# Altium schematic sheet Multi-Sensor-V2.0.SchDoc
size A2
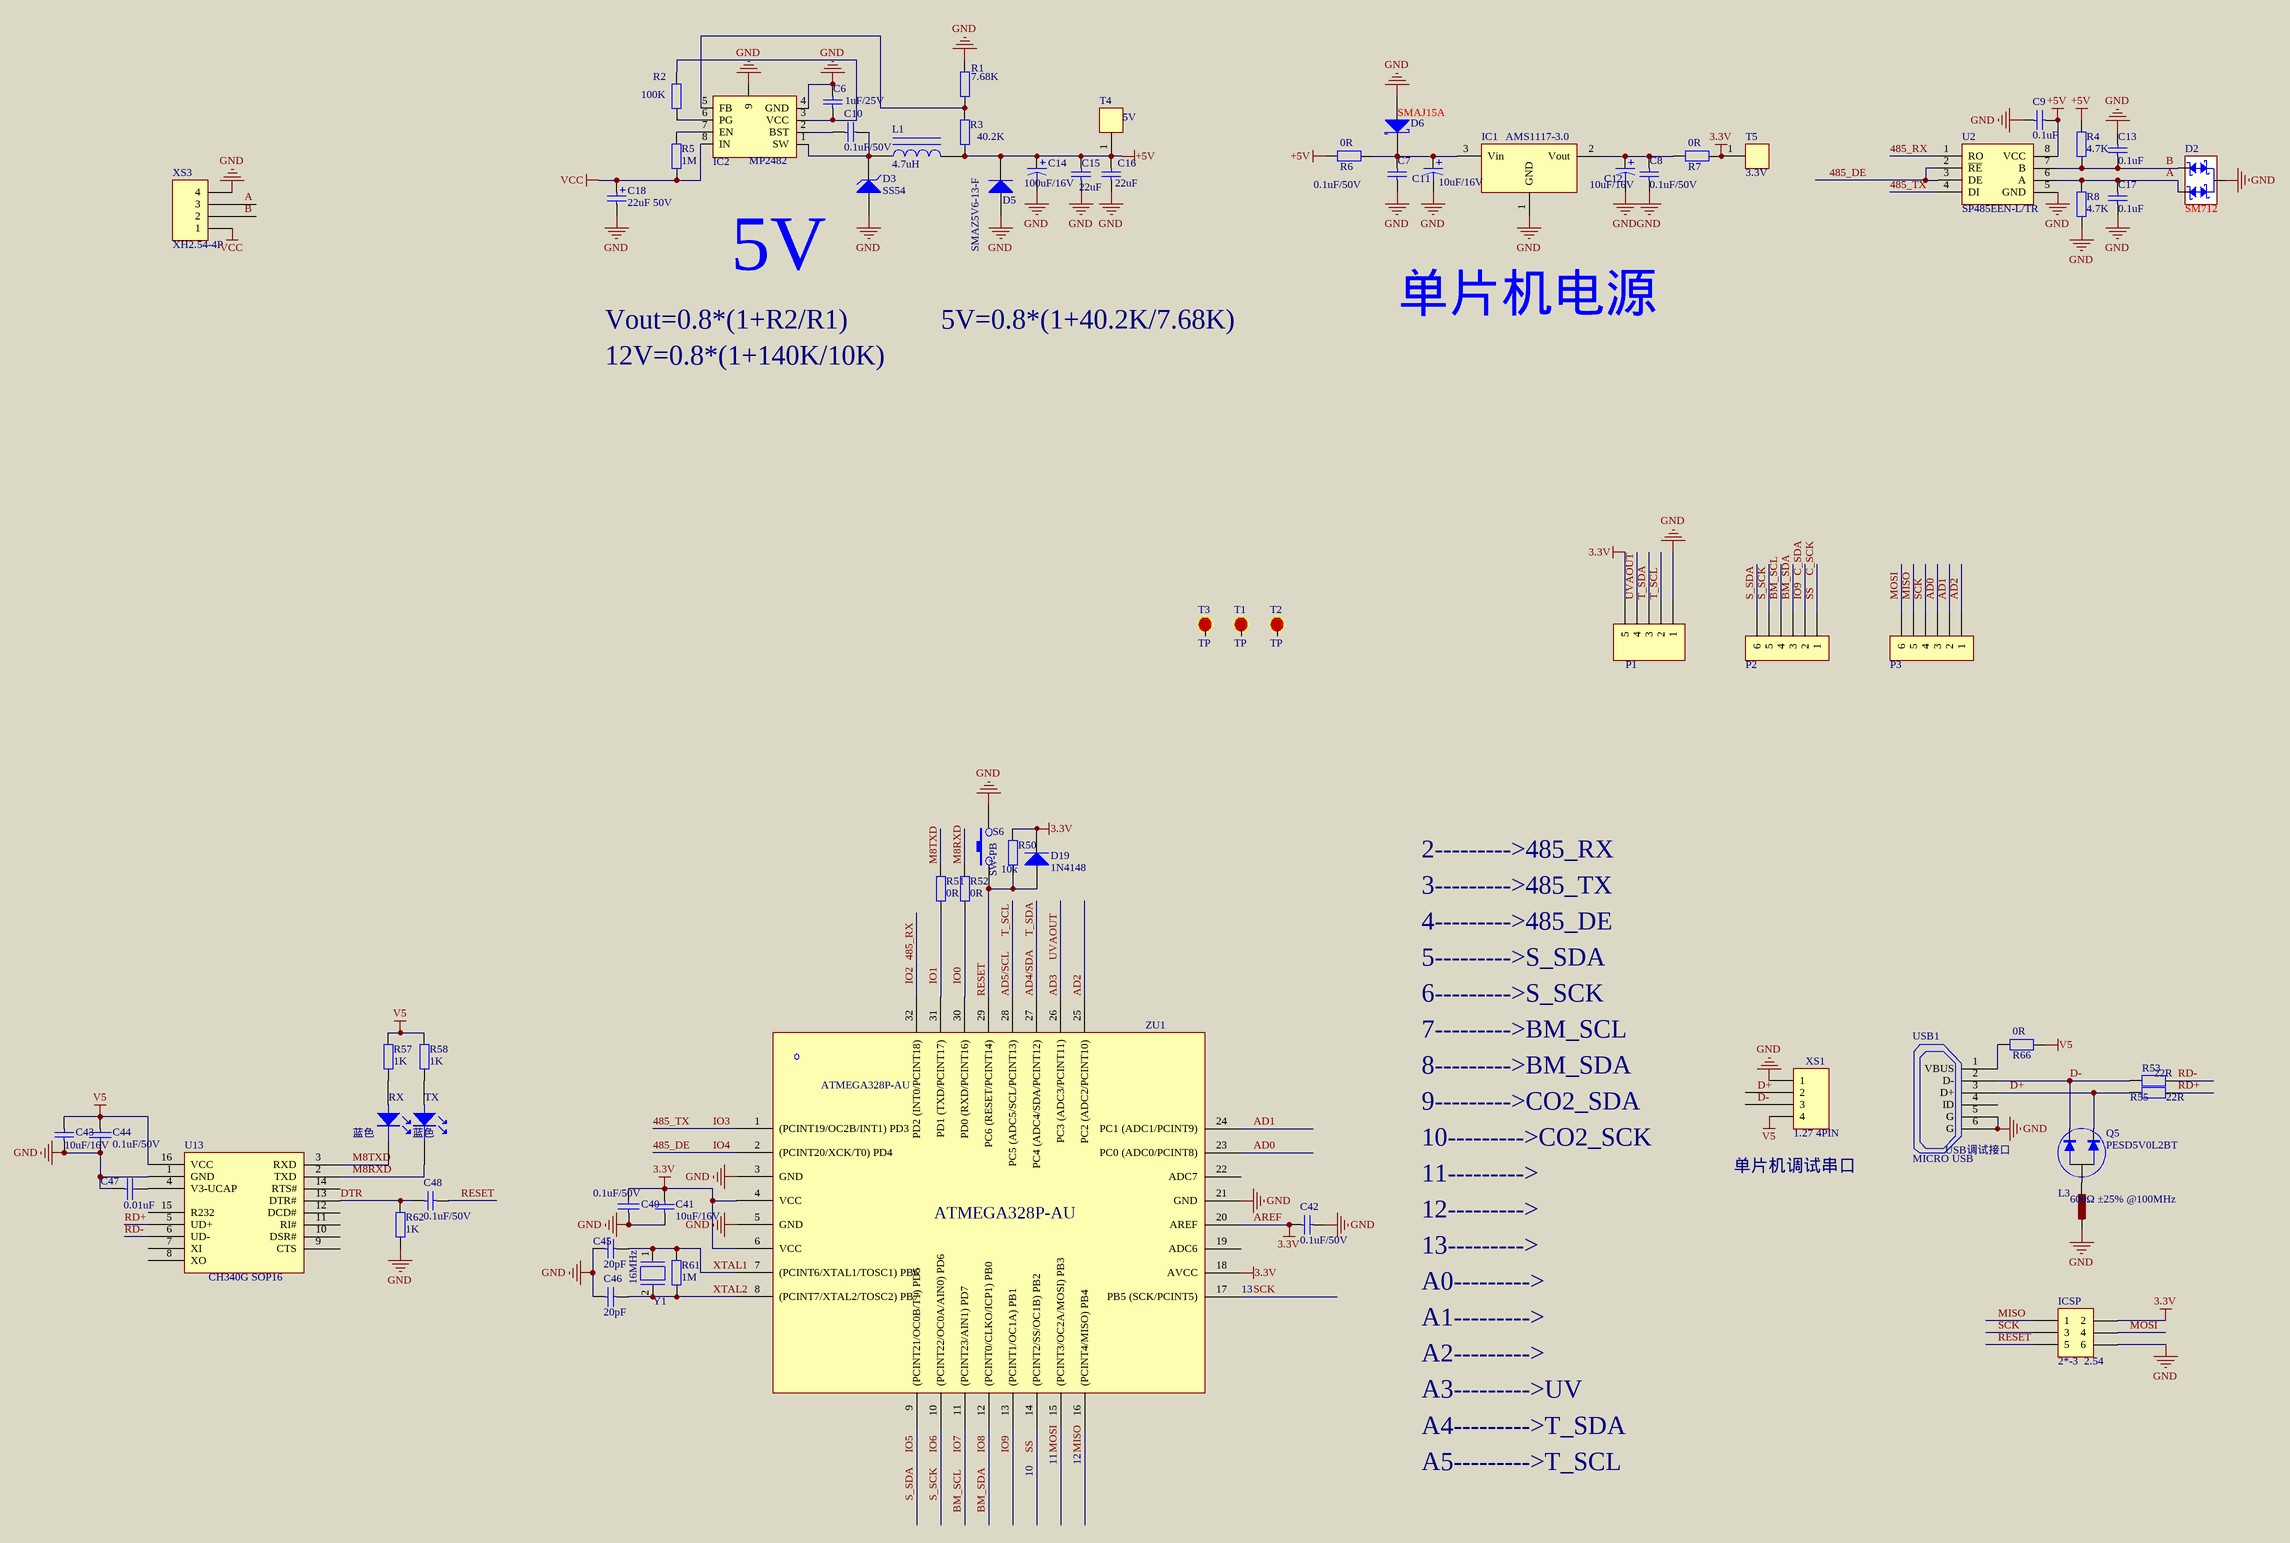
[diagram p0: Multi-Sensor-V2.0.SchDoc]

## Parts
C6  1uF/25V  [C-0805]
C7  0.1uF/50V  [C-0805]
C8  0.1uF/50V  [C-0805]
C9  0.1uF  [C-0603]
C10  0.1uF/50V  [C-0805]
C11  10uF/16V  [C-3216]
C12  10uF/16V  [C-3216]
C13  0.1uF  [C-0603]
C14  100uF/16V  [CAP5*X]
C15  22uF  [C-1206]
C16  22uF  [C-1206]
C17  0.1uF  [C-0603]
C18  22uF 50V  [CAP5*X]
C40  0.1uF/50V  [C-0603]
C41  10uF/16V  [C-0805]
C42  0.1uF/50V  [C-0603]
C43  10uF/16V  [C-0805]
C44  0.1uF/50V  [C-0603]
C45  20pF  [C-0603]
C46  20pF  [C-0603]
C47  0.01uF  [C-0603]
C48  0.1uF/50V  [C-0603]
D2  SM712  [SOT-23-3]
D3  SS54  [SMA(DO-214AC)]
D5  SMAZ5V6-13-F  [SMA(DO-214AC)]
D6  SMAJ15A  [SMA(DO-214AC)]
D19  1N4148  [SOD-123]
IC1  AMS1117-3.0  [SOT-223]
IC2  MP2482  [SO8 -TP]
ICSP  2*-3  2.54  [201S2X3]
L1  4.7uH  [GDCD8040]
L3  600Ω ±25% @100MHz  [L-0805]
P1  JXT-5-l  [JXT-5-l]  (value not drawn)
P2  JXT-6-l  [JXT-6-l]  (value not drawn)
P3  JXT-6-l  [JXT-6-l]  (value not drawn)
Q5  PESD5V0L2BT  [SOT-23-3]
R1  7.68K  [R-0805]
R2  100K  [R-0805]
R3  40.2K  [R-0805]
R4  4.7K  [R-0603]
R5  1M  [R-0805]
R6  0R  [R-0805]
R7  0R  [R-0603]
R8  4.7K  [R-0603]
R50  10k  [R-0603]
R51  0R  [R-0603]
R52  0R  [R-0603]
R53  22R  [R-0603]
R55  22R  [R-0603]
R57  1K  [R-0603]
R58  1K  [R-0603]
R61  1M  [R-0603]
R62  1K  [R-0603]
R66  0R  [R-0603]
RX  蓝色  [LED-0603]
S6  SW-PB  [轻触(3*6*4.3)]
T1  TP  [安装孔-M6]
T2  TP  [安装孔-M6]
T3  TP  [安装孔-M6]
T4  5V  [TEST_POINT]
T5  3.3V  [TEST_POINT]
TX  蓝色  [LED-0603]
U2  SP485EEN-L/TR  [SOP-8_150mil]
U13  CH340G SOP16  [SOIC16_39MM]
USB1  MICRO USB  [MICRO_USB]
XS1  1.27 4PIN  [JXT-4-l]
XS3  XH2.54-4P  [XH2.54-4P]
Y1  16MHz  [hc49s]
ZU1  ATMEGA328P-AU  [TQFP-32_7x7x08P]

## Nets
+5V: C9.2 C14.1 C15.2 C16.2 D5.2(K) L1.2 R3.2 R4.1 R6.1 T4.1 U2.8(VCC)
AREF: C40.2 C41.2 C42.2 D19.2(K) ICSP.2 P1.5 R7.2 R50.1 T5.1 ZU1.4(VCC) ZU1.6(VCC) ZU1.18(AVCC) ZU1.20(AREF)  [also labelled 3.3V]
GND: C6.1 C7.1 C8.1 C9.1 C11.2 C12.2 C13.1 C14.2 C15.1 C16.1 C17.2 C18.2 C40.1 C41.1 C42.1 C43.2 C44.2 C45.1 C46.1 C47.1 D2.3 D3.1(A) D5.1(A) D6.1(A) IC1.1(GND) IC2.4(GND) IC2.9 ICSP.6 L3.2 P1.1 R1.2 R8.2 R62.2 S6.2 U2.5(GND) U13.1(GND) USB1.5(G) USB1.6(G) XS1.1 XS3.4 ZU1.3(GND) ZU1.5(GND) ZU1.21(GND)
V5: C43.1 C44.1 R57.1 R58.1 R66.2 U13.16(VCC) XS1.4
VCC: C18.1 IC2.8(IN) R5.1 XS3.1
485_DE: U2.2(~{RE}) U2.3(DE) ZU1.2((PCINT20/XCK/T0)_PD4)  [also labelled IO4]
485_RX: U2.1(RO) ZU1.32(PD2_(INT0/PCINT18))  [also labelled IO2]
485_TX: U2.4(DI) ZU1.1((PCINT19/OC2B/INT1)_PD3)  [also labelled IO3]
A: C17.1 D2.2 R8.1 U2.6(A) XS3.3
AD0: P3.3 ZU1.23(PC0_(ADC0/PCINT8))
AD1: P3.2 ZU1.24(PC1_(ADC1/PCINT9))
AD2: P3.1 ZU1.25(PC2_(ADC2/PCINT10))
AD3: P1.4 ZU1.26(PC3_(ADC3/PCINT11))  [also labelled UVAOUT]
AD4/SDA: P1.3 ZU1.27(PC4_(ADC4/SDA/PCINT12))  [also labelled T_SDA]
AD5/SCL: P1.2 ZU1.28(PC5_(ADC5/SCL/PCINT13))  [also labelled T_SCL]
B: C13.2 D2.1 R4.2 U2.7(B) XS3.2
BM_SCL: P2.4 ZU1.11((PCINT23/AIN1)_PD7)  [also labelled IO7]
BM_SDA: P2.3 ZU1.12((PCINT0/CLKO/ICP1)_PB0)  [also labelled IO8]
C_SCK: P2.1 ZU1.14((PCINT2/SS/OC1B)_PB2)  [also labelled SS]
C_SDA: P2.2 ZU1.13((PCINT1/OC1A)_PB1)  [also labelled IO9]
D+: Q5.2 R55.2 USB1.3(D+) XS1.2
D-: Q5.1 R53.2 USB1.2(D-) XS1.3
DTR: C48.2 R62.1 U13.13(DTR#)
IO0: R52.2 ZU1.30(PD0_(RXD/PCINT16))
IO1: R51.2 ZU1.31(PD1_(TXD/PCINT17))
IO5: P2.6 ZU1.9((PCINT21/OC0B/T1)_PD5)  [also labelled S_SDA]
IO6: P2.5 ZU1.10((PCINT22/OC0A/AIN0)_PD6)  [also labelled S_SCK]
M8RXD: R52.1 TX.K U13.2(TXD)
M8TXD: R51.1 RX.K U13.3(RXD)
MISO: ICSP.1 P3.5 ZU1.16((PCINT4/MISO)_PB4)
MOSI: ICSP.4 P3.6 ZU1.15((PCINT3/OC2A/MOSI)_PB3)
RD+: R55.1 U13.5(UD+)
RD-: R53.1 U13.6(UD-)
RESET: C48.1 D19.1(A) ICSP.5 R50.2 S6.1 ZU1.29(PC6_(RESET/PCINT14))
SCK: ICSP.3 P3.4 ZU1.17(PB5_(SCK/PCINT5))
XTAL1: C45.2 R61.1 Y1.1 ZU1.7((PCINT6/XTAL1/TOSC1)_PB6)
XTAL2: C46.2 R61.2 Y1.2 ZU1.8((PCINT7/XTAL2/TOSC2)_PB7)
NetC6_2: C6.2 IC2.3(VCC) R2.2
NetC7_2: C7.2 C11.1 D6.2(K) IC1.3(Vin) R6.2
NetC8_2: C8.2 C12.1 IC1.2(Vout) R7.1
NetC10_1: C10.1 D3.2(K) IC2.1(SW) L1.1
NetC10_2: C10.2 IC2.2(BST)
NetC47_2: C47.2 U13.4(V3-UCAP)
NetIC2_5: IC2.5(FB) R1.1 R3.1
NetIC2_6: IC2.6(PG) R2.1
NetIC2_7: IC2.7(EN) R5.2
NetL3_1: L3.1 Q5.3
NetR57_2: R57.2 RX.A
NetR58_2: R58.2 TX.A
NetR66_1: R66.1 USB1.1(VBUS)

Not connected (* = marked no-connect by the designer): T1 1(T); T2 1(T); T3 1(T); U13 7(XI) 8(XO) 9(CTS) 10(DSR#) 11(RI#) 12(DCD#) 14(RTS#) 15(R232); USB1 4(ID); ZU1 19(ADC6) 22(ADC7)

## Notes on the sheet
- 5V
- Vout=0.8*(1+R2/R1)
- 12V=0.8*(1+140K/10K)
- 5V=0.8*(1+40.2K/7.68K)
- 单片机电源
- 3--------->485_TX
- 2--------->485_RX
- 4--------->485_DE
- 5--------->S_SDA
- 6--------->S_SCK
- 7--------->BM_SCL
- 8--------->BM_SDA
- 9--------->CO2_SDA
- 10--------->CO2_SCK
- (near USB1) USB调试接口
- 11--------->
- (near XS1) 单片机调试串口
- 13--------->
- 12--------->
- (near ZU1) 13
- A0--------->
- A1--------->
- A2--------->
- A3--------->UV
- A4--------->T_SDA
- 10
- 11
- 12
- A5--------->T_SCL

## Library data of the parts
C6-C10 C13 C15-C17 C45 C46 = Cap: 贴片电容; Published: 8-Jun-2000; LatestRevisionDate: 17-Jul-2002; LatestRevisionNote: Re-released for DXP Platform.; PackageReference: RAD-0.3; Publisher: Altium Limited; PackageDescription: Radial Cap, Thru-Hole; 2 Leads; 0.3 in Pin Spacing
  C6: Value: 1uF/25V
  C7 C8 C10: Value: 0.1uF/50V
  C9 C13 C17: Value: 0.1uF
  C15 C16: Value: 22uF
  C45 C46: Value: 20pF
C11 C12 = Ca: 钽电容; Published: 8-Jun-2000; LatestRevisionDate: 17-Jul-2002; LatestRevisionNote: Re-released for DXP Platform.; PackageReference: RB7.6-15; Publisher: Altium Limited; Value: 10uF/16V
C14 = Ca: 直插电解电容; Published: 8-Jun-2000; LatestRevisionDate: 17-Jul-2002; LatestRevisionNote: Re-released for DXP Platform.; PackageReference: RB7.6-15; Publisher: Altium Limited; Value: 100uF/16V
C18 = Cap_1: 钽电容; ComponentLink1Description: 供应商链接; ComponentLink1URL: http://www.szlcsc.com/product/details_7643.html; Package: 3216; Supplier: LC; SuppliersPartNumber: C7171
C40 C44 C47 = CAP: 贴片电容
C41 C43 = Cap: 贴片电容; Value: 10uF/25V; Published: 8-Jun-2000; LatestRevisionDate: 17-Jul-2002; LatestRevisionNote: Re-released for DXP Platform.; PackageReference: RAD-0.3; Publisher: Altium Limited
C42 C48 = Cap: 贴片电容; Value: 0.1uF; Published: 8-Jun-2000; LatestRevisionDate: 17-Jul-2002; LatestRevisionNote: Re-released for DXP Platform.; PackageReference: RAD-0.3; Publisher: Altium Limited; PackageDescription: Radial Cap, Thru-Hole; 2 Leads; 0.3 in Pin Spacing
D2 = SM712: TVS二极管; Code - JEDEC: DO-214-AA; Published: 8-Jun-2000; Revision: July-2002: Re-released for DXP Platform.; Publisher: Altium Limited
D3 = D Zener: 肖特基二极管; Published: 8-Jun-2000; LatestRevisionDate: 17-Jul-2002; LatestRevisionNote: Re-released for DXP Platform.; PackageReference: DIODE-0.7; Publisher: Altium Limited; PackageDescription: Diode, Thru-Hole; 2 Leads; 0.7 in Pin Spacing
D5 = Diode: 稳压二极管管; Published: 8-Jun-2000; LatestRevisionDate: 17-Jul-2002; LatestRevisionNote: Re-released for DXP Platform.; PackageDocument: Sep-1996; PackageReference: SMC; Publisher: Altium Limited; Code_JEDEC: DO-214-AB
D6 = D Schottky: TVS二极管; Code - JEDEC: DO-214-AA; Published: 8-Jun-2000; Revision: July-2002: Re-released for DXP Platform.; Publisher: Altium Limited
D19 = 开关二极管: ComponentLink1Description: 供应商链接; ComponentLink1URL: http://www.szlcsc.com/product/details_10338.html; Package: LL-34; Supplier: LC; SuppliersPartNumber: C9808
IC1 = AMS1117-3.0: 电源稳压芯片
IC2 = MP2482: DC-DC芯片
ICSP = Header 2*3: 单排插针; LatestRevisionDate: 17-Jul-2002; LatestRevisionNote: Re-released for DXP Platform.; Publisher: Altium Limited
L1 = Inductor Iron: 功率电感; Published: 24-Mar-1999; LatestRevisionDate: 17-Jul-2002; LatestRevisionNote: Re-released for DXP Platform.; PackageReference: AXIAL-0.9; Publisher: Altium Limited; PackageDescription: Axial Device, Thru-Hole; 2 Leads; 0.9 in Pin Spacing; Value: 4.7uH
L3 = L: 贴片磁珠
P1 = Header 5: 1.27立式贴片针座; LatestRevisionDate: 17-Jul-2002; LatestRevisionNote: Re-released for DXP Platform.; Publisher: Altium Limited
P2 P3 = Header 6: 1.27立式贴片针座; LatestRevisionDate: 17-Jul-2002; LatestRevisionNote: Re-released for DXP Platform.; Publisher: Altium Limited
Q5 = ESD1: TVS二极管
R1 R6 R7 R66 = Res2: 贴片电阻; Published: 8-Jun-2000; LatestRevisionDate: 17-Jul-2002; LatestRevisionNote: Re-released for DXP Platform.; PackageReference: AXIAL-0.4; Publisher: Altium Limited; PackageDescription: Axial Device, Thru-Hole; 2 Leads; 0.4 in Pin Spacing
  R1: Value: 7.68K
  R6 R7 R66: Value: 0R
R2 = Res2: 贴片电阻; Value: 100R; Published: 8-Jun-2000; LatestRevisionDate: 17-Jul-2002; LatestRevisionNote: Re-released for DXP Platform.; PackageReference: AXIAL-0.4; Publisher: Altium Limited; PackageDescription: Axial Device, Thru-Hole; 2 Leads; 0.4 in Pin Spacing
R3 R4 R8 R50-R52 R57 R58 R61 R62 = R: 贴片电阻; Published: 8-Jun-2000; LatestRevisionDate: 17-Jul-2002; LatestRevisionNote: Re-released for DXP Platform.; PackageReference: AXIAL-0.4; Publisher: Altium Limited
  R3: PackageDescription: Axial Device, Thru-Hole; 2 Leads; 0.4 in Pin Spacing; Value: 40.2K
  R4 R8: PackageDescription: Axial Device, Thru-Hole; 2 Leads; 0.4 in Pin Spacing; Value: 4.7K
  R50: Value: 10k
  R51 R52: PackageDescription: Axial Device, Thru-Hole; 2 Leads; 0.4 in Pin Spacing; Value: 0R
  R57 R58 R62: PackageDescription: Axial Device, Thru-Hole; 2 Leads; 0.4 in Pin Spacing; Value: 1K
  R61: PackageDescription: Axial Device, Thru-Hole; 2 Leads; 0.4 in Pin Spacing; Value: 1M
R5 = 贴片电阻: ComponentLink1Description: 供应商链接; ComponentLink1URL: http://www.szlcsc.com/product/details_18068.html; Package: 0805; Supplier: LC; SuppliersPartNumber: C17380
R53 R55 = R: 贴片电阻; Value: 1K; Published: 8-Jun-2000; LatestRevisionDate: 17-Jul-2002; LatestRevisionNote: Re-released for DXP Platform.; PackageReference: AXIAL-0.4; Publisher: Altium Limited; PackageDescription: Axial Device, Thru-Hole; 2 Leads; 0.4 in Pin Spacing
RX TX = LED: 贴片发光二极管
S6 = SW-PB: 微型按键开关
T4 = TEST_POINT: 测试点
T5 = TEST_POINT
U2 = SP485EEN-L/TR: RS485收发芯片
U13 = CH340G: USB-TTL接口芯片
USB1 = MICRO USB_1
XS1 = Hea: 1.27卧式贴片针座; LatestRevisionDate: 17-Jul-2002; LatestRevisionNote: Re-released for DXP Platform.; Publisher: Altium Limited
XS3 = Hea: 2.54卧式贴片针座; LatestRevisionDate: 17-Jul-2002; LatestRevisionNote: Re-released for DXP Platform.; Publisher: Altium Limited
Y1 = XTAL/S: 无源晶振
ZU1 = ATMEGA328P-AU: 单片机